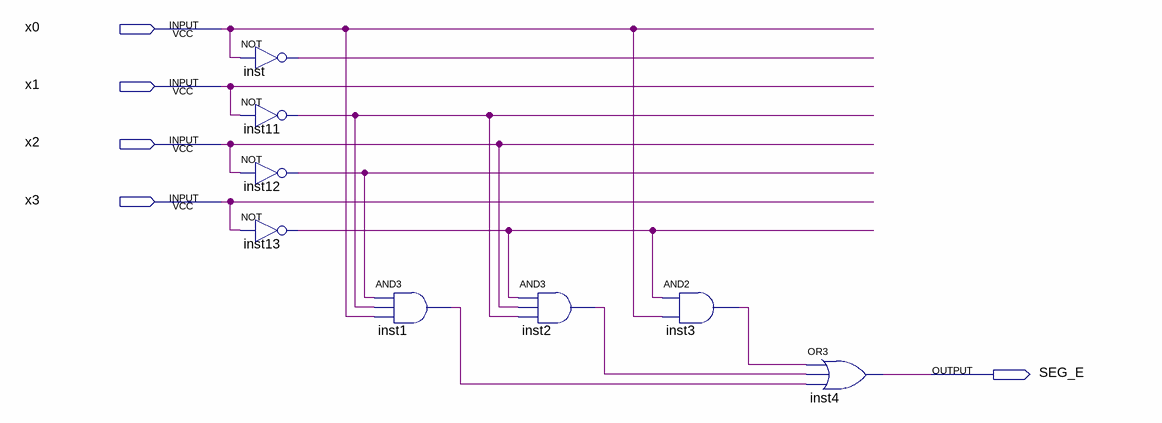
[diagram p0: schematic sheet]
// Quartus schematic SEG_E.bdf as structural Verilog: 8 symbols, 5 pins
module SEG_E (
  input  x0,
  input  x1,
  input  x2,
  input  x3,
  output SEG_E
);

  wire inst1_out, inst2_out, inst3_out, inst11_out, inst12_out, inst13_out, inst_out;

  not inst (inst_out, x0);
  not inst11 (inst11_out, x1);
  not inst12 (inst12_out, x2);
  not inst13 (inst13_out, x3);
  and inst1 (inst1_out, inst12_out, inst11_out, x0);
  and inst2 (inst2_out, inst13_out, x2, inst11_out);
  and inst3 (inst3_out, inst13_out, x0);
  or inst4 (SEG_E, inst3_out, inst2_out, inst1_out);
endmodule
